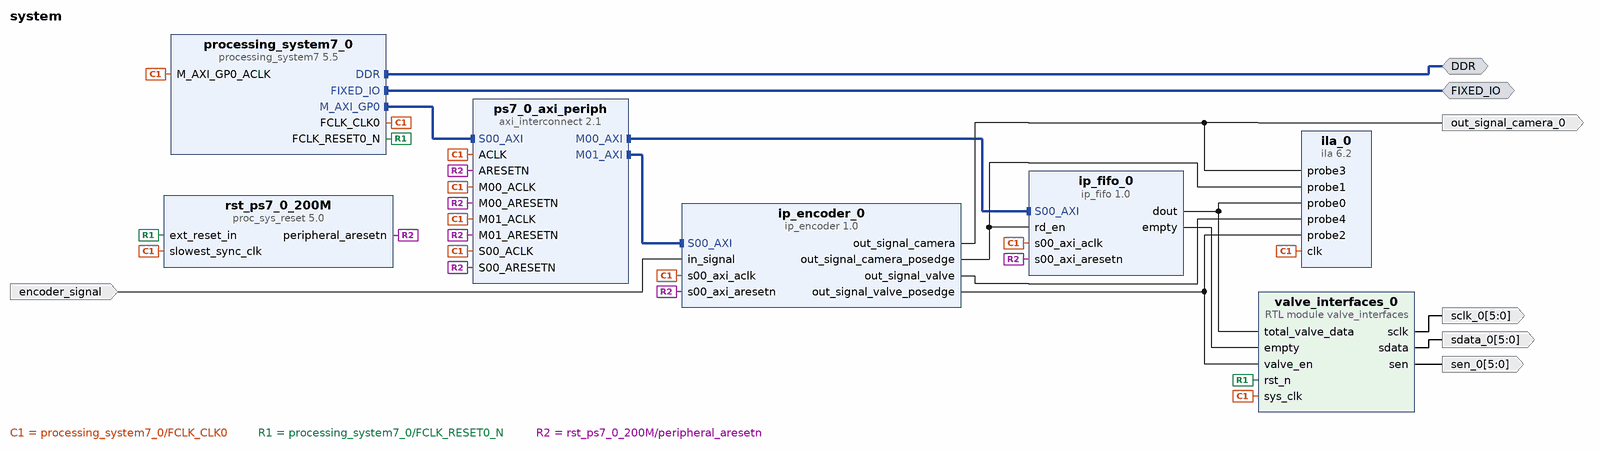
[diagram p0: block diagram of the top level]
# Vivado block design system, xc7z010clg400-1, Vivado 2021.2
create_bd_design system

create_bd_intf_port -mode Master -vlnv xilinx.com:interface:ddrx_rtl:1.0 DDR
create_bd_intf_port -mode Master -vlnv xilinx.com:display_processing_system7:fixedio_rtl:1.0 FIXED_IO
create_bd_port -dir O -from 5 -to 0 sen_0
create_bd_port -dir O -from 5 -to 0 sclk_0
create_bd_port -dir O -from 5 -to 0 sdata_0
create_bd_port -dir I encoder_signal
create_bd_port -dir O out_signal_camera_0

create_bd_cell -type ip -vlnv xilinx.com:ip:processing_system7:5.5 processing_system7_0
set_property -dict [list \
  CONFIG.PCW_FPGA0_PERIPHERAL_FREQMHZ 200 \
  CONFIG.PCW_UART0_PERIPHERAL_ENABLE 1 \
  CONFIG.PCW_UART0_UART0_IO {MIO 14 .. 15} \
  CONFIG.PCW_UART_PERIPHERAL_FREQMHZ 100 \
  CONFIG.PCW_UIPARAM_DDR_PARTNO {MT41J128M16 HA-125} \
] [get_bd_cells processing_system7_0]
# 42 more settings of processing_system7_0 are not shown: defaults, MIO pin electricals, DDR timing, and values the tool derives
create_bd_cell -type ip -vlnv xilinx.com:ip:axi_interconnect:2.1 ps7_0_axi_periph
set_property -dict {CONFIG.NUM_MI 2 CONFIG.S00_HAS_DATA_FIFO 2 CONFIG.STRATEGY 2} [get_bd_cells ps7_0_axi_periph]
create_bd_cell -type ip -vlnv xilinx.com:ip:proc_sys_reset:5.0 rst_ps7_0_200M
create_bd_cell -type ip -vlnv user.org:user:ip_encoder:1.0 ip_encoder_0
create_bd_cell -type ip -vlnv xilinx.com:ip:ila:6.2 ila_0
set_property -dict [list \
  CONFIG.C_DATA_DEPTH 4096 \
  CONFIG.C_ENABLE_ILA_AXI_MON false \
  CONFIG.C_MONITOR_TYPE Native \
  CONFIG.C_NUM_OF_PROBES 5 \
  CONFIG.C_PROBE0_WIDTH 48 \
  CONFIG.C_PROBE3_WIDTH 1 \
  CONFIG.C_PROBE4_WIDTH 1 \
  CONFIG.C_PROBE5_WIDTH 1 \
] [get_bd_cells ila_0]
create_bd_cell -type module -reference valve_interfaces valve_interfaces_0
create_bd_cell -type ip -vlnv user.org:user:ip_fifo:1.0 ip_fifo_0

# ---- connections ----

connect_bd_intf_net [get_bd_intf_ports DDR] [get_bd_intf_pins processing_system7_0/DDR]
connect_bd_intf_net [get_bd_intf_ports FIXED_IO] [get_bd_intf_pins processing_system7_0/FIXED_IO]
connect_bd_intf_net [get_bd_intf_pins processing_system7_0/M_AXI_GP0] [get_bd_intf_pins ps7_0_axi_periph/S00_AXI]
connect_bd_intf_net [get_bd_intf_pins ps7_0_axi_periph/M00_AXI] [get_bd_intf_pins ip_fifo_0/S00_AXI]
connect_bd_intf_net [get_bd_intf_pins ps7_0_axi_periph/M01_AXI] [get_bd_intf_pins ip_encoder_0/S00_AXI]
connect_bd_net -net in_signal_0_1 [get_bd_ports encoder_signal] [get_bd_pins ip_encoder_0/in_signal]
connect_bd_net [get_bd_pins ip_encoder_0/out_signal_camera] [get_bd_ports out_signal_camera_0] [get_bd_pins ila_0/probe3]
connect_bd_net [get_bd_pins ip_encoder_0/out_signal_camera_posedge] [get_bd_pins ila_0/probe1] [get_bd_pins ip_fifo_0/rd_en]
connect_bd_net [get_bd_pins ip_encoder_0/out_signal_valve] [get_bd_pins ila_0/probe4]
connect_bd_net [get_bd_pins ip_encoder_0/out_signal_valve_posedge] [get_bd_pins valve_interfaces_0/valve_en] [get_bd_pins ila_0/probe2]
connect_bd_net [get_bd_pins ip_fifo_0/dout] [get_bd_pins ila_0/probe0] [get_bd_pins valve_interfaces_0/total_valve_data]
connect_bd_net [get_bd_pins ip_fifo_0/empty] [get_bd_pins valve_interfaces_0/empty]
connect_bd_net [get_bd_pins processing_system7_0/FCLK_CLK0] \
  [get_bd_pins processing_system7_0/M_AXI_GP0_ACLK] [get_bd_pins ps7_0_axi_periph/S00_ACLK] \
  [get_bd_pins rst_ps7_0_200M/slowest_sync_clk] [get_bd_pins ps7_0_axi_periph/M00_ACLK] [get_bd_pins ps7_0_axi_periph/ACLK] \
  [get_bd_pins ps7_0_axi_periph/M01_ACLK] [get_bd_pins ip_encoder_0/s00_axi_aclk] [get_bd_pins ila_0/clk] \
  [get_bd_pins valve_interfaces_0/sys_clk] [get_bd_pins ip_fifo_0/s00_axi_aclk]
connect_bd_net [get_bd_pins processing_system7_0/FCLK_RESET0_N] [get_bd_pins valve_interfaces_0/rst_n] [get_bd_pins rst_ps7_0_200M/ext_reset_in]
connect_bd_net [get_bd_pins rst_ps7_0_200M/peripheral_aresetn] \
  [get_bd_pins ps7_0_axi_periph/S00_ARESETN] [get_bd_pins ps7_0_axi_periph/M00_ARESETN] \
  [get_bd_pins ps7_0_axi_periph/ARESETN] [get_bd_pins ps7_0_axi_periph/M01_ARESETN] \
  [get_bd_pins ip_encoder_0/s00_axi_aresetn] [get_bd_pins ip_fifo_0/s00_axi_aresetn]
connect_bd_net [get_bd_pins valve_interfaces_0/sclk] [get_bd_ports sclk_0]
connect_bd_net [get_bd_pins valve_interfaces_0/sdata] [get_bd_ports sdata_0]
connect_bd_net [get_bd_pins valve_interfaces_0/sen] [get_bd_ports sen_0]

# ---- address map ----
assign_bd_address -offset 0x43C00000 -range 64K -target_address_space [get_bd_addr_spaces processing_system7_0/Data] [get_bd_addr_segs ip_fifo_0/S00_AXI/S00_AXI_reg]
assign_bd_address -offset 0x43C10000 -range 64K -target_address_space [get_bd_addr_spaces processing_system7_0/Data] [get_bd_addr_segs ip_encoder_0/S00_AXI/S00_AXI_reg]

validate_bd_design
save_bd_design
